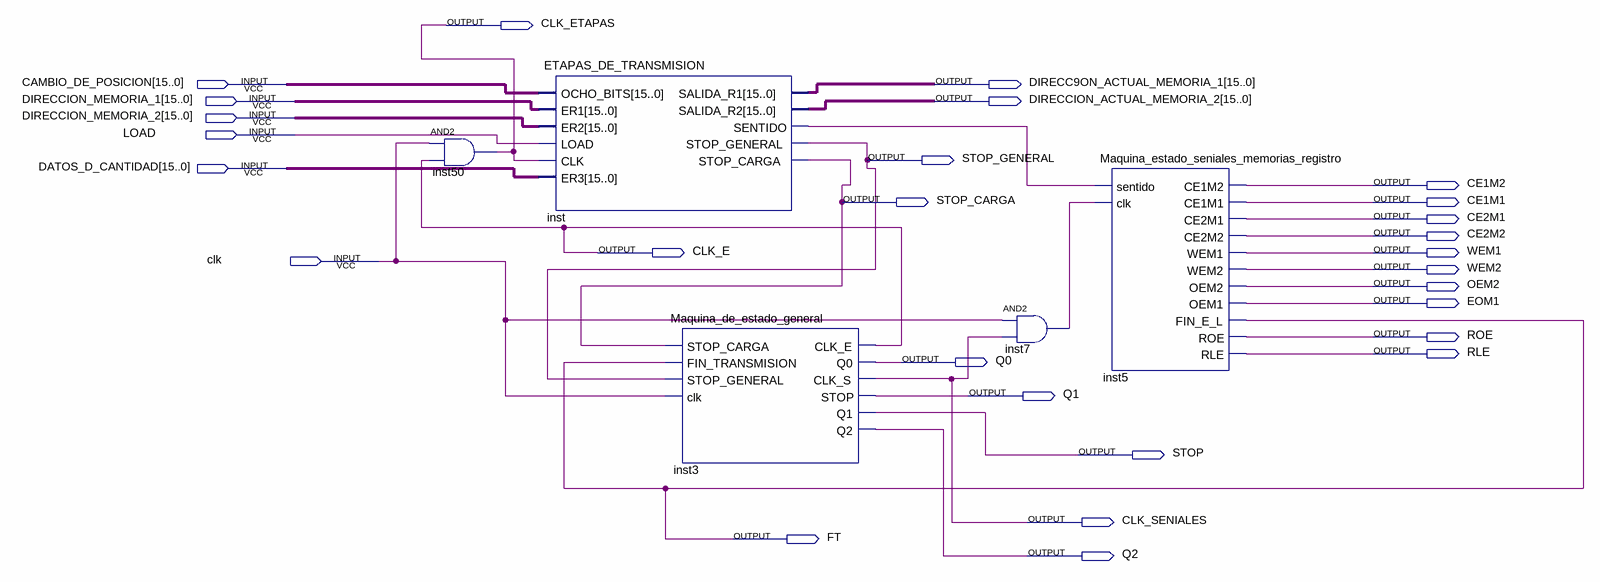
[diagram p0: schematic sheet]
// Quartus schematic main.bdf as structural Verilog: 5 symbols, 28 pins
module main (
  input  [15:0] CAMBIO_DE_POSICION,
  input  [15:0] DIRECCION_MEMORIA_1,
  input  [15:0] DIRECCION_MEMORIA_2,
  input  LOAD,
  input  [15:0] DATOS_D_CANTIDAD,
  input  clk,
  output CLK_ETAPAS,
  output [15:0] DIRECC9ON_ACTUAL_MEMORIA_1,
  output [15:0] DIRECCION_ACTUAL_MEMORIA_2,
  output STOP_GENERAL,
  output CE1M2,
  output STOP_CARGA,
  output CE1M1,
  output CE2M1,
  output CE2M2,
  output CLK_E,
  output WEM1,
  output WEM2,
  output OEM2,
  output EOM1,
  output ROE,
  output RLE,
  output Q0,
  output Q1,
  output STOP,
  output CLK_SENIALES,
  output FT,
  output Q2
);

  wire inst7_out, inst_sentido;

  and inst50 (CLK_ETAPAS, clk, CLK_E);
  ETAPAS_DE_TRANSMISION inst (
    .OCHO_BITS(CAMBIO_DE_POSICION), .ER1(DIRECCION_MEMORIA_1), .ER2(DIRECCION_MEMORIA_2), .LOAD(LOAD),
    .CLK(CLK_ETAPAS), .ER3(DATOS_D_CANTIDAD), .SALIDA_R1(DIRECC9ON_ACTUAL_MEMORIA_1),
    .SALIDA_R2(DIRECCION_ACTUAL_MEMORIA_2), .SENTIDO(inst_sentido), .STOP_GENERAL(STOP_GENERAL),
    .STOP_CARGA(STOP_CARGA));
  Maquina_de_estado_general inst3 (
    .STOP_CARGA(STOP_CARGA), .FIN_TRANSMISION(FT), .STOP_GENERAL(STOP_GENERAL), .clk(clk), .CLK_E(CLK_E),
    .Q0(Q0), .CLK_S(CLK_SENIALES), .STOP(Q1), .Q1(STOP), .Q2(Q2));
  and inst7 (inst7_out, clk, CLK_SENIALES);
  Maquina_estado_seniales_memorias_registro inst5 (
    .sentido(inst_sentido), .clk(inst7_out), .CE1M2(CE1M2), .CE1M1(CE1M1), .CE2M1(CE2M1), .CE2M2(CE2M2),
    .WEM1(WEM1), .WEM2(WEM2), .OEM2(OEM2), .OEM1(EOM1), .FIN_E_L(FT), .ROE(ROE), .RLE(RLE));
endmodule
